# EAGLE design OpenHealth_rj45v2 (EAGLE 7.2.0)
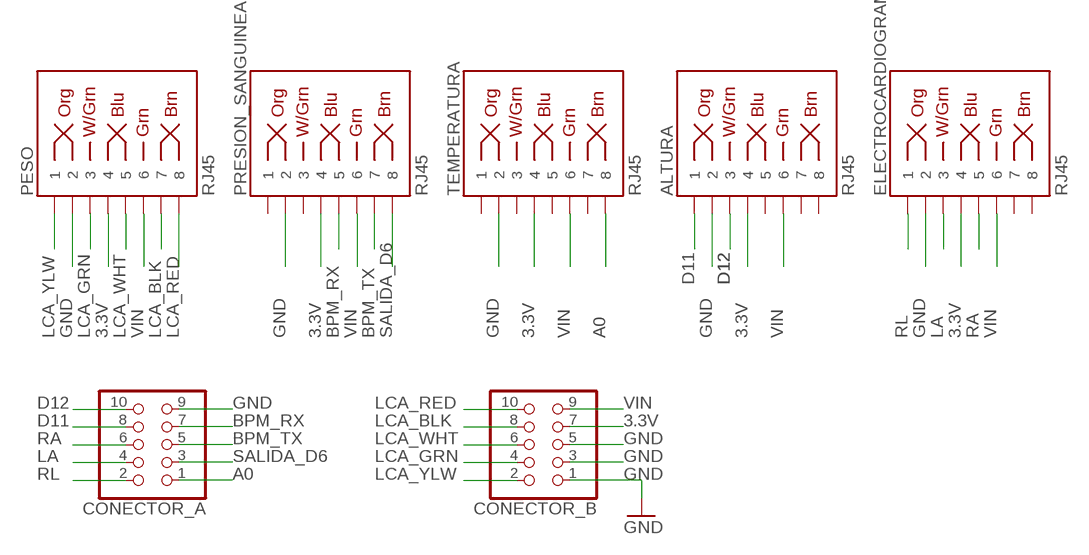
[diagram p0: schematic, sheet 1]

## Parts
ALTURA  RJ45  RJ45-8PTH  [RJ45-8]
CONECTOR_A  PINHD-2X5  [2X05]
CONECTOR_B  PINHD-2X5  [2X05]
ELECTROCARDIOGRAMA  RJ45  RJ45-8PTH  [RJ45-8]
PESO  RJ45  RJ45-8PTH  [RJ45-8]
PRESION_SANGUINEA  RJ45  RJ45-8PTH  [RJ45-8]
TEMPERATURA  RJ45  RJ45-8PTH  [RJ45-8]

## Nets
3.3V: ALTURA.4 CONECTOR_B.7 ELECTROCARDIOGRAMA.4 PESO.4 PRESION_SANGUINEA.4 TEMPERATURA.4
A0: CONECTOR_A.1 TEMPERATURA.8
BPM_RX: CONECTOR_A.7 PRESION_SANGUINEA.5
BPM_TX: CONECTOR_A.5 PRESION_SANGUINEA.7
D11: ALTURA.1 CONECTOR_A.8
D12: ALTURA.3 CONECTOR_A.10
GND: ALTURA.2 CONECTOR_A.9 CONECTOR_B.1 CONECTOR_B.3 CONECTOR_B.5 ELECTROCARDIOGRAMA.2 PESO.2 PRESION_SANGUINEA.2 TEMPERATURA.2
LA: CONECTOR_A.4 ELECTROCARDIOGRAMA.3
LCA_BLK: CONECTOR_B.8 PESO.7
LCA_GRN: CONECTOR_B.4 PESO.3
LCA_RED: CONECTOR_B.10 PESO.8
LCA_WHT: CONECTOR_B.6 PESO.5
LCA_YLW: CONECTOR_B.2 PESO.1
RA: CONECTOR_A.6 ELECTROCARDIOGRAMA.5
RL: CONECTOR_A.2 ELECTROCARDIOGRAMA.1
SALIDA_D6: CONECTOR_A.3 PRESION_SANGUINEA.8
VIN: ALTURA.6 CONECTOR_B.9 ELECTROCARDIOGRAMA.6 PESO.6 PRESION_SANGUINEA.6 TEMPERATURA.6
Unconnected: ALTURA.5 ALTURA.7 ALTURA.8 ELECTROCARDIOGRAMA.7 ELECTROCARDIOGRAMA.8 PRESION_SANGUINEA.1 PRESION_SANGUINEA.3 TEMPERATURA.1 TEMPERATURA.3 TEMPERATURA.5 TEMPERATURA.7

## Library data of the parts
ALTURA ELECTROCARDIOGRAMA PESO PRESION_SANGUINEA TEMPERATURA = SparkFun-Connectors:RJ45-8: RJ45 Jack Simple RJ45, 8-pin connection - connector for common Cat5, Cat5e, and Cat6 Ethernet cables. Footprint not yet proven in production. Connector sku is PRT-00643; Breakout PCB sku is BOB-00716.; PROD_ID: CONN-08506
CONECTOR_A CONECTOR_B = pinhead:PINHD-2X5: PIN HEADER

## Board
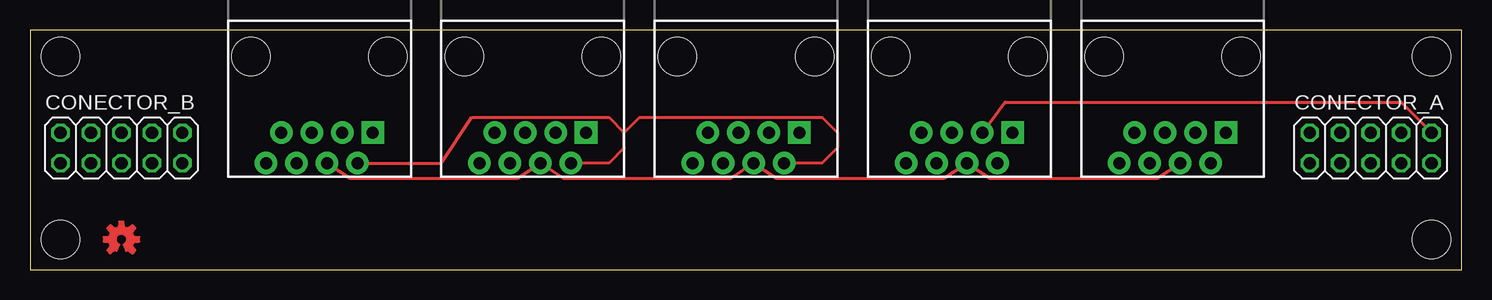
[diagram p1: board, top side]
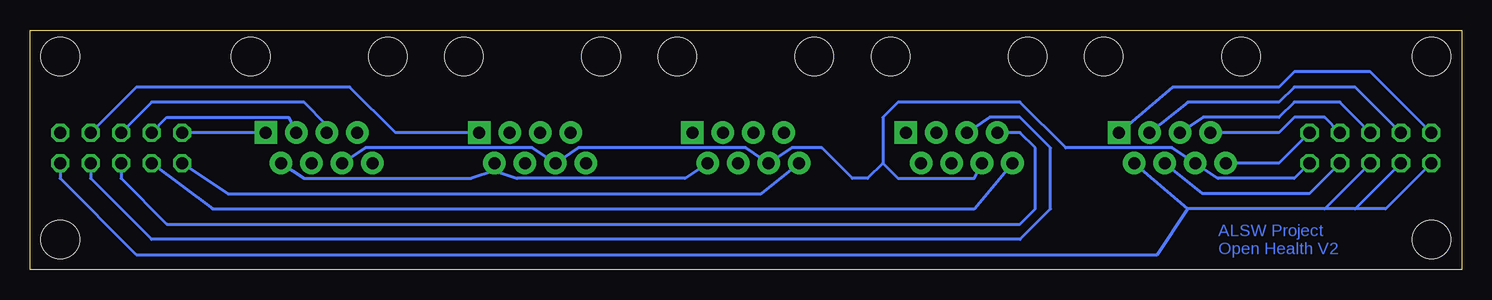
[diagram p2: board, bottom side, seen from below]

Size 119.36 x 19.99 mm. Coordinates in mm from the lower left corner, seen from the top.
Outline: 0,0 119.36,0 119.36,19.99 0,19.99 0,0
Copper layers (1*16): Top 0.0356mm / dielectric 1.5011mm / Bottom 0.0356mm
Design rules "LaenPCBOrder": minimum track width 6mil, minimum drill 13mil, track to track 6mil, track to pad 6mil, pad to pad 6mil, via to via 6mil, smd to smd 6mil, copper to edge 15mil, drill to drill 6mil, minimum pad ring 7mil, minimum via ring 7mil, stop-mask expansion 3mil, vias tented up to drill 0mil, thermal gap 10mil
Holes 3.2 mm at 2.54,17.78 2.54,2.54 116.84,17.78 116.84,2.54

### Footprints (pad centres in the part's own frame; a part is rotated, then mirrored left to right if it is on the bottom)
RJ45-8 = drill 1 pad 1.88 square: 1 -4.445,6.35 | drill 1 pad 1.88: 2 -3.175,8.89; 3 -1.905,6.35; 4 -0.635,8.89; 5 0.635,6.35; 6 1.905,8.89; 7 3.175,6.35; 8 4.445,8.89 | hole 3.2: -5.715,0; 5.715,0
2X05 = drill 1.016 octagon: 1 -5.08,-1.27; 2 -5.08,1.27; 3 -2.54,-1.27; 4 -2.54,1.27; 5 0,-1.27; 6 0,1.27; 7 2.54,-1.27; 8 2.54,1.27; 9 5.08,-1.27; 10 5.08,1.27

### Placement (x,y rotation side)
ALTURA  77.47,17.78 180 top
CONECTOR_A  111.76,10.16 0 top
CONECTOR_B  7.62,10.16 0 top
ELECTROCARDIOGRAMA  95.25,17.78 180 top
PESO  24.13,17.78 180 top
PRESION_SANGUINEA  41.91,17.78 180 top
TEMPERATURA  59.69,17.78 180 top
U$1  [OSHW-LOGO-S_COPPER]  7.62,2.54 0 top

### Tracks (layer width: path | path; a pad name or v marks a point on that pad's centre or on a via)
3.3V
  Top 0.254: PESO.4 26.67,7.62 40.64,7.62 PRESION_SANGUINEA.4 44.45,7.62 58.42,7.62 TEMPERATURA.4 62.23,7.62 76.2,7.62 ALTURA.4 80.01,7.62 93.98,7.62 ELECTROCARDIOGRAMA.4
  Bottom 0.254: CONECTOR_B.7 12.7,6.35 21.59,6.35 PESO.4
A0
  Bottom 0.254: CONECTOR_A.1 102.87,6.35 58.42,6.35 TEMPERATURA.8
BPM_RX
  Bottom 0.254: CONECTOR_A.7 114.3,7.62 109.22,2.54 36.83,2.54 34.29,5.08 34.29,10.16 36.83,12.7 39.37,12.7 PRESION_SANGUINEA.5
BPM_TX
  Bottom 0.254: CONECTOR_A.5 111.76,7.62 107.95,3.81 36.83,3.81 35.56,5.08 35.56,10.16 36.83,11.43 PRESION_SANGUINEA.7
D11
  Bottom 0.254: ALTURA.1 88.9,11.43 92.71,15.24 110.49,15.24 CONECTOR_A.8
D12
  Top 0.254: ALTURA.3 81.28,13.97 114.3,13.97 CONECTOR_A.10
GND
  Top 0.254: PESO.2 34.29,8.89 36.83,12.7 48.26,12.7 49.53,11.43 | PRESION_SANGUINEA.2 48.26,8.89 49.53,10.16 49.53,11.43 | 49.53,11.43 50.8,12.7 66.04,12.7 67.31,11.43 67.31,10.16 66.04,8.89 TEMPERATURA.2
  Bottom 0.254: CONECTOR_A.9 116.84,7.62 110.49,1.27 25.4,1.27 22.86,5.08 | ELECTROCARDIOGRAMA.2 96.52,7.62 82.55,7.62 80.64,8.26 | 80.64,8.26 78.74,7.62 64.77,7.62 TEMPERATURA.2 | 80.64,8.26 ALTURA.2 | CONECTOR_B.5 11.43,5.08 | 11.43,5.08 22.86,5.08 | 22.86,5.08 PESO.2 | CONECTOR_B.3 8.89,5.08 | 8.89,5.08 11.43,5.08 | CONECTOR_B.1 6.35,5.08 8.89,5.08
LA
  Bottom 0.254: CONECTOR_A.4 107.95,12.7 97.79,12.7 ELECTROCARDIOGRAMA.3
LCA_BLK
  Bottom 0.254: CONECTOR_B.8 11.43,12.7 13.97,12.7 15.24,11.43 PESO.7
LCA_GRN
  Bottom 0.254: CONECTOR_B.4 8.89,15.24 13.97,15.24 15.24,13.97 22.86,13.97 PESO.3
LCA_RED
  Bottom 0.254: CONECTOR_B.10 15.24,8.89 PESO.8
LCA_WHT
  Bottom 0.254: CONECTOR_B.6 10.16,13.97 13.97,13.97 15.24,12.7 21.59,12.7 PESO.5
LCA_YLW
  Bottom 0.254: CONECTOR_B.2 7.62,16.51 13.97,16.51 15.24,15.24 24.13,15.24 PESO.1
RA
  Bottom 0.254: CONECTOR_A.6 109.22,13.97 96.52,13.97 94.61,12.06 ELECTROCARDIOGRAMA.5
RL
  Bottom 0.254: ELECTROCARDIOGRAMA.1 CONECTOR_A.2
SALIDA_D6
  Bottom 0.254: PRESION_SANGUINEA.8 40.64,5.08 104.14,5.08 CONECTOR_A.3
VIN
  Bottom 0.254: ELECTROCARDIOGRAMA.6 91.44,10.16 77.47,10.16 ALTURA.6 73.66,10.16 59.69,10.16 TEMPERATURA.6 55.88,10.16 53.34,10.16 50.8,7.62 49.53,7.62 48.26,8.89 | CONECTOR_B.9 13.97,7.62 20.32,7.62 PESO.6 24.13,10.16 33.02,10.16 36.83,13.97 46.99,13.97 48.26,12.7 48.26,8.89 | 48.26,8.89 46.99,7.62 40.64,7.62 PRESION_SANGUINEA.6

### Text on the board
Bottom: ALSW Project / Open Health V2